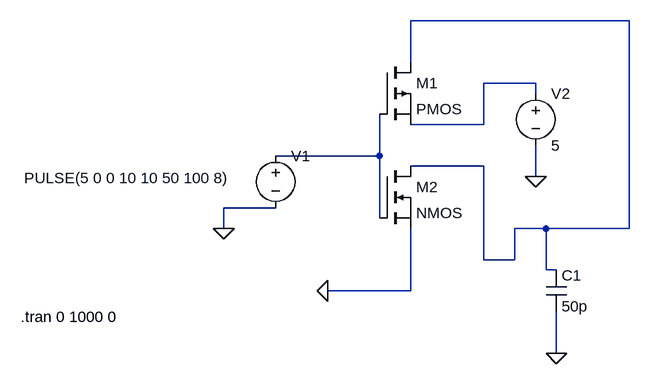
[diagram p0: schematic cmos_not_50pF_basic_sqmtc.asc]
cmos_not_50pF_basic_sqmtc.asc, the LTspice schematic file:
Version 4
SHEET 1 4716 1876
WIRE 544 0 208 0
WIRE 208 64 208 0
WIRE 400 96 320 96
WIRE 400 112 400 96
WIRE 320 160 320 96
WIRE 320 160 208 160
WIRE 160 208 160 144
WIRE 160 208 0 208
WIRE 320 224 208 224
WIRE 400 240 400 192
WIRE 0 288 -80 288
WIRE 160 304 160 208
WIRE -80 320 -80 288
WIRE 416 320 368 320
WIRE 544 320 544 0
WIRE 544 320 416 320
WIRE 320 368 320 224
WIRE 368 368 368 320
WIRE 368 368 320 368
WIRE 416 384 416 320
WIRE 432 384 416 384
WIRE 208 416 208 320
WIRE 208 416 80 416
WIRE 432 512 432 448
FLAG 80 416 0
FLAG 432 512 0
FLAG 400 240 0
FLAG -80 320 0
DATAFLAG 416 320 ""
DATAFLAG 432 480 ""
DATAFLAG 416 368 ""
DATAFLAG 544 160 ""
DATAFLAG 320 256 ""
DATAFLAG 160 416 ""
DATAFLAG -64 288 ""
DATAFLAG 160 208 ""
DATAFLAG 320 96 ""
DATAFLAG 208 32 ""
DATAFLAG 176 272 ""
SYMBOL pmos 160 64 R0
SYMATTR InstName M1
SYMBOL nmos 160 224 R0
SYMATTR InstName M2
SYMBOL voltage 0 192 R0
WINDOW 3 -387 50 Left 2
WINDOW 123 0 0 Left 0
WINDOW 39 0 0 Left 0
SYMATTR Value PULSE(5 0 0 10 10 50 100 8)
SYMATTR InstName V1
SYMBOL voltage 400 96 R0
WINDOW 123 0 0 Left 0
WINDOW 39 0 0 Left 0
SYMATTR InstName V2
SYMATTR Value 5
SYMBOL cap 416 384 R0
SYMATTR InstName C1
SYMATTR Value 50p
TEXT -392 456 Left 2 !.tran 0 1000 0

The netlist it stands for:
* cmos_not_50pF_basic_sqmtc.asc
M1 N001 N003 N002 N002 PMOS
M2 N001 N003 0 0 NMOS
V1 N003 0 PULSE(5 0 0 10 10 50 100 8)
V2 N002 0 5
C1 N001 0 50p
.model NMOS NMOS
.model PMOS PMOS
.lib standard.mos
.tran 0 1000 0
.backanno
.end